# Altium schematic sheet DC-Motor-DRV.SchDoc
size Tabloid
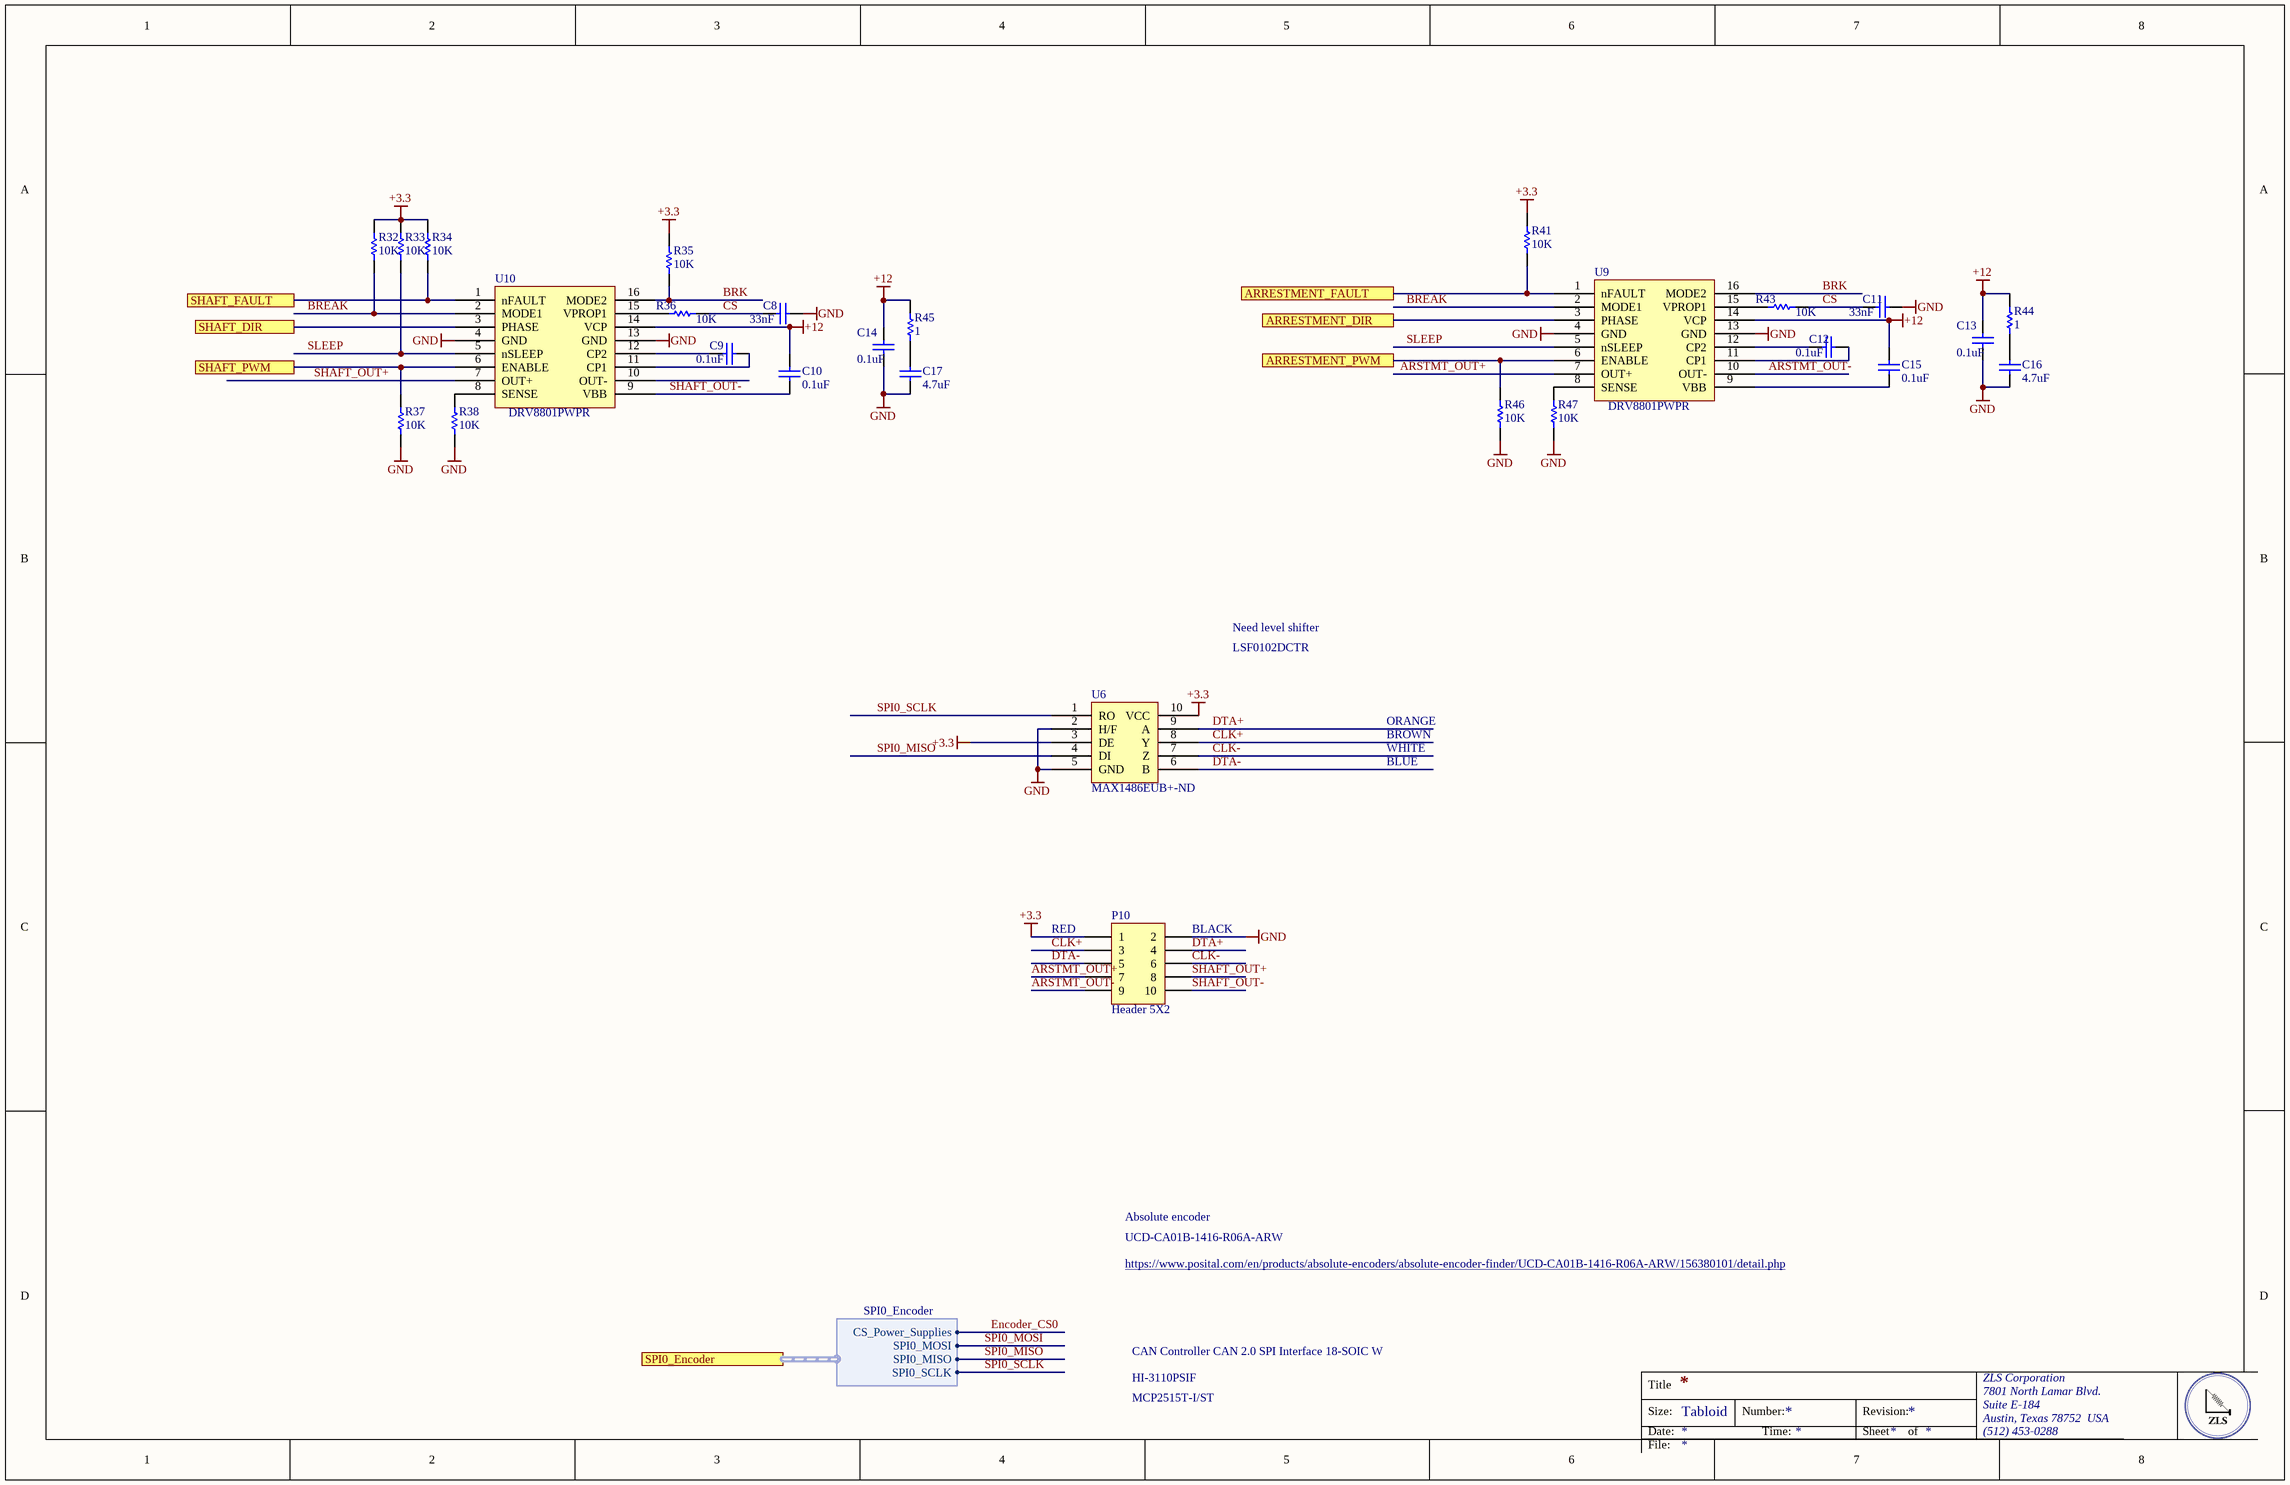
[diagram p0: DC-Motor-DRV.SchDoc]

## Parts
C8  33nF  [CAPC0402(1005)60_L]
C9  0.1uF  [CAPC0402(1005)60_L]
C10  0.1uF  [CAPC0402(1005)60_L]
C11  33nF  [CAPC0402(1005)60_L]
C12  0.1uF  [CAPC0402(1005)60_L]
C13  0.1uF  [CAPC0402(1005)60_L]
C14  0.1uF  [CAPC0402(1005)60_L]
C15  0.1uF  [CAPC0402(1005)60_L]
C16  4.7uF  [CAPC0402(1005)60_L]
C17  4.7uF  [CAPC0402(1005)60_L]
P10  Header 5X2  [HDR2X5]
R32  10K  [RESC0402(1005)_M]
R33  10K  [RESC0402(1005)_M]
R34  10K  [RESC0402(1005)_M]
R35  10K  [RESC0402(1005)_M]
R36  10K  [RESC0402(1005)_M]
R37  10K  [RESC0402(1005)_M]
R38  10K  [RESC0402(1005)_M]
R41  10K  [RESC0402(1005)_M]
R43  10K  [RESC0402(1005)_M]
R44  1  [RESC0402(1005)_M]
R45  1  [RESC0402(1005)_M]
R46  10K  [RESC0402(1005)_M]
R47  10K  [RESC0402(1005)_M]
U6  Supplier Part Number 1: MAX1486EUB+-ND  [MAX1486EUB+]  (hidden comment: MAX1486EUB+)
U9  DRV8801PWPR  [DRV8801PWPR]
U10  DRV8801PWPR  [DRV8801PWPR]

## Ports
ARRESTMENT_DIR, ARRESTMENT_FAULT, ARRESTMENT_PWM, SHAFT_DIR, SHAFT_FAULT, SHAFT_PWM, SPI0_Encoder (harness SPI0_Encoder)

## Harnesses
SPI0_Encoder: CS_Power_Supplies, SPI0_MOSI, SPI0_MISO, SPI0_SCLK

## Nets
+3.3: P10.1 R32.2 R33.2 R34.2 R35.2 R41.2 U6.3(DE) U6.10(VCC)
+12: C10.2 C13.2 C14.2 C15.2 R44.2 R45.2 U9.14(VCP) U10.14(VCP)
GND: C8.2 C11.2 C13.1 C14.1 C16.1 C17.1 P10.2 R37.1 R38.1 R46.1 R47.1 U6.2(H/F) U6.5(GND) U9.4(GND) U9.13(GND) U10.4(GND) U10.13(GND)
ARRESTMENT_DIR: U9.3(PHASE) ; port ARRESTMENT_DIR
ARRESTMENT_FAULT: R41.1 U9.1(nFAULT) ; port ARRESTMENT_FAULT
ARRESTMENT_PWM: R46.2 U9.6(ENABLE) ; port ARRESTMENT_PWM
ARSTMT_OUT+: P10.7 U9.7(OUT+)
ARSTMT_OUT-: P10.9 U9.10(OUT-)
BREAK: R32.1 U9.2(MODE1) U10.2(MODE1)
BRK: R35.1 U9.16(MODE2) U10.16(MODE2)
CLK+: P10.3 U6.8(Y)
CLK-: P10.6 U6.7(Z)
CS: C8.1 C11.1 R36.2 R43.2
DTA+: P10.4 U6.9(A)
DTA-: P10.5 U6.6(B)
Encoder_CS0: port SPI0_Encoder.CS_Power_Supplies
SHAFT_DIR: U10.3(PHASE) ; port SHAFT_DIR
SHAFT_FAULT: R34.1 U10.1(nFAULT) ; port SHAFT_FAULT
SHAFT_OUT+: P10.8 U10.7(OUT+)
SHAFT_OUT-: C10.1 P10.10 U10.9(VBB)
SHAFT_PWM: R37.2 U10.6(ENABLE) ; port SHAFT_PWM
SLEEP: R33.1 U9.5(nSLEEP) U10.5(nSLEEP)
SPI0_MISO: U6.4(DI) ; port SPI0_Encoder.SPI0_MISO
SPI0_MOSI: port SPI0_Encoder.SPI0_MOSI
SPI0_SCLK: U6.1(RO) ; port SPI0_Encoder.SPI0_SCLK
NetC9_1: C9.1 U10.11(CP1)
NetC9_2: C9.2 U10.12(CP2)
NetC12_1: C12.1 U9.11(CP1)
NetC12_2: C12.2 U9.12(CP2)
NetC15_1: C15.1 U9.9(VBB)
NetC16_2: C16.2 R44.1
NetC17_2: C17.2 R45.1
NetR36_1: R36.1 U10.15(VPROP1)
NetR38_2: R38.2 U10.8(SENSE)
NetR43_1: R43.1 U9.15(VPROP1)
NetR47_2: R47.2 U9.8(SENSE)

Not connected (* = marked no-connect by the designer): U10 10(OUT-)

## Notes on the sheet
- Need level shifter
- LSF0102DCTR
- BROWN
- WHITE
- ORANGE
- BLUE
- (near P10) RED
- (near P10) BLACK
- Absolute encoder
- UCD-CA01B-1416-R06A-ARW
- https://www.posital.com/en/products/absolute-encoders/absolute-encoder-finder/UCD-CA01B-1416-R06A-ARW/156380101/detail.php
- CAN Controller CAN 2.0 SPI Interface 18-SOIC W
- HI-3110PSIF
- MCP2515T-I/ST
- Title
- Size:
- Date:
- Tabloid
- Number:
- Time:
- Revision:
- Sheet
- of
- ZLS Corporation
- 7801 North Lamar Blvd.
- Suite E-184
- Austin, Texas 78752  USA
- (512) 453-0288
- File:

## Library data of the parts
C8-C17 = CMP-1034-00252-1: CAP CER 0.1UF 10V X7R 0402; Manufacturer: Murata Electronics North America; Manufacturer Part Number: GRM155R71A104KA01D; Tolerance: ±10%; Supplier 1: Digi-Key; Supplier Part Number 1: 490-6321-1-ND; RoHS: RoHS Compliant; Category: Capacitors; Stock 1: 2920395; Pricing 1: 1=0.1, 10=0.014, 100=0.0063, 500=0.00446, 1000=0.00351, 2500=0.00319, 5000=0.00293 (USD); Packaging: Cut Tape (CT); Part Status: Active; Voltage - Rated: 10V; Temperature Coefficient: X7R; Operating Temperature: -55°C ~ 125°C; Features: -; Ratings: -; Applications: General Purpose; Mounting Type: Surface Mount, MLCC; Package / Case: 0402 (1005 Metric); Size / Dimension: 0.039" L x 0.020" W (1.00mm x 0.50mm); Height - Seated (Max): -; Thickness (Max): 0.022" (0.55mm); Lead Spacing: -; ComponentLink1URL: http://www.murata.com/~/media/webrenewal/support/library/catalog/products/capacitor/mlcc/c02e.ashx?la=en-us; ComponentLink1Description: http://www.murata.com/~/media/webrenewal/support/library/catalog/products/capacitor/mlcc/c02e.ashx?la=en-us
P10 = Header 5X2: Header, 5-Pin, Dual row; LatestRevisionDate: 17-Jul-2002; LatestRevisionNote: Re-released for DXP Platform.; Publisher: Altium Limited
R32-R38 R41 R43-R47 = CMP-1011-00651-1
U6 = MAX1486EUB+: Manufacturer: Maxim Integrated; Protocol: RS422, RS485; Number of Drivers/Receivers: 1/1; Duplex: Full; Data Rate: 12Mbps; Voltage - Supply: 4.75 V ~ 5.25 V; Supplier 1: Digi-Key; Manufacturer Part Number: MAX1486EUB+; RoHS: RoHS Compliant; Category: Integrated Circuits (ICs); Stock 1: 554; Pricing 1: 1=2.57, 10=2.442, 25=2.28 (USD); Packaging: Tube; Part Status: Active; Type: Transceiver; Operating Temperature: -40°C ~ 85°C; Mounting Type: Surface Mount; Package / Case: 10-TFSOP, 10-MSOP (0.118", 3.00mm Width); Supplier Device Package: 10-uMAX; Base Part Number: MAX1486; ComponentLink1URL: http://datasheets.maximintegrated.com/en/ds/MAX1481-MAX1486.pdf; ComponentLink1Description: http://datasheets.maximintegrated.com/en/ds/MAX1481-MAX1486.pdf
U9 U10 = DRV8801PWPR: Manufacturer: Texas Instruments; Motor Type - Stepper: Bipolar; Motor Type - AC, DC: Brushed DC; Function: Driver - Fully Integrated, Control and Power Stage; Output Configuration: Half Bridge (2); Interface: Parallel; Current - Output: 2.8A; Voltage - Supply: 8 V ~ 38 V; Supplier 1: Digi-Key; Supplier Part Number 1: 296-25378-1-ND; Manufacturer Part Number: DRV8801PWPR; RoHS: RoHS Compliant; Category: Integrated Circuits (ICs); Stock 1: 40424; Pricing 1: 1=2.37, 10=2.126, 100=1.709, 500=1.40414, 1000=1.16344 (USD); Packaging: Cut Tape (CT); Part Status: Active; Technology: DMOS; Step Resolution: -; Applications: General Purpose; Voltage - Load: 8 V ~ 38 V; Operating Temperature: -40°C ~ 150°C (TJ); Mounting Type: Surface Mount; Package / Case: 16-TSSOP (0.173", 4.40mm Width) Exposed Pad; Supplier Device Package: 16-HTSSOP; Base Part Number: DRV8801; ComponentLink1URL: http://www.ti.com/lit/ds/symlink/drv8801.pdf; ComponentLink1Description: http://www.ti.com/lit/ds/symlink/drv8801.pdf